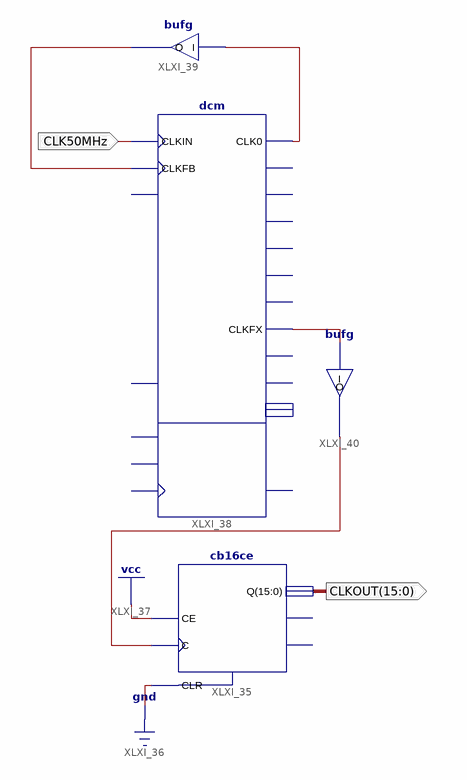
[diagram p0: schematic sheet 1]
// Xilinx ISE schematic hello_clock2.sch (spartan3) as structural Verilog: 4 symbols, 2 ports
module hello_clock2 (
  input  CLK50MHz,
  output [15:0] CLKOUT
);

  wire CLK1MHz, XLXN_72, XLXN_73, XLXN_74;

  dcm #(.CLKFX_MULTIPLY(2), .CLKFX_DIVIDE(3)) XLXI_38 (
    .CLKFB(XLXN_74), .CLKIN(CLK50MHz), .CLK0(XLXN_73), .CLKFX(XLXN_72));  // open: DSSEN, PSCLK, PSEN, PSINCDEC, RST, CLK180, CLK270, CLK2X, CLK2X180, CLK90, CLKDV, CLKFX180, LOCKED, PSDONE, STATUS
  bufg XLXI_39 (.I(XLXN_73), .O(XLXN_74));
  bufg XLXI_40 (.I(XLXN_72), .O(CLK1MHz));
  cb16ce XLXI_35 (.C(CLK1MHz), .CE(1'b1), .CLR(1'b0), .Q(CLKOUT));  // open: CEO, TC
endmodule
